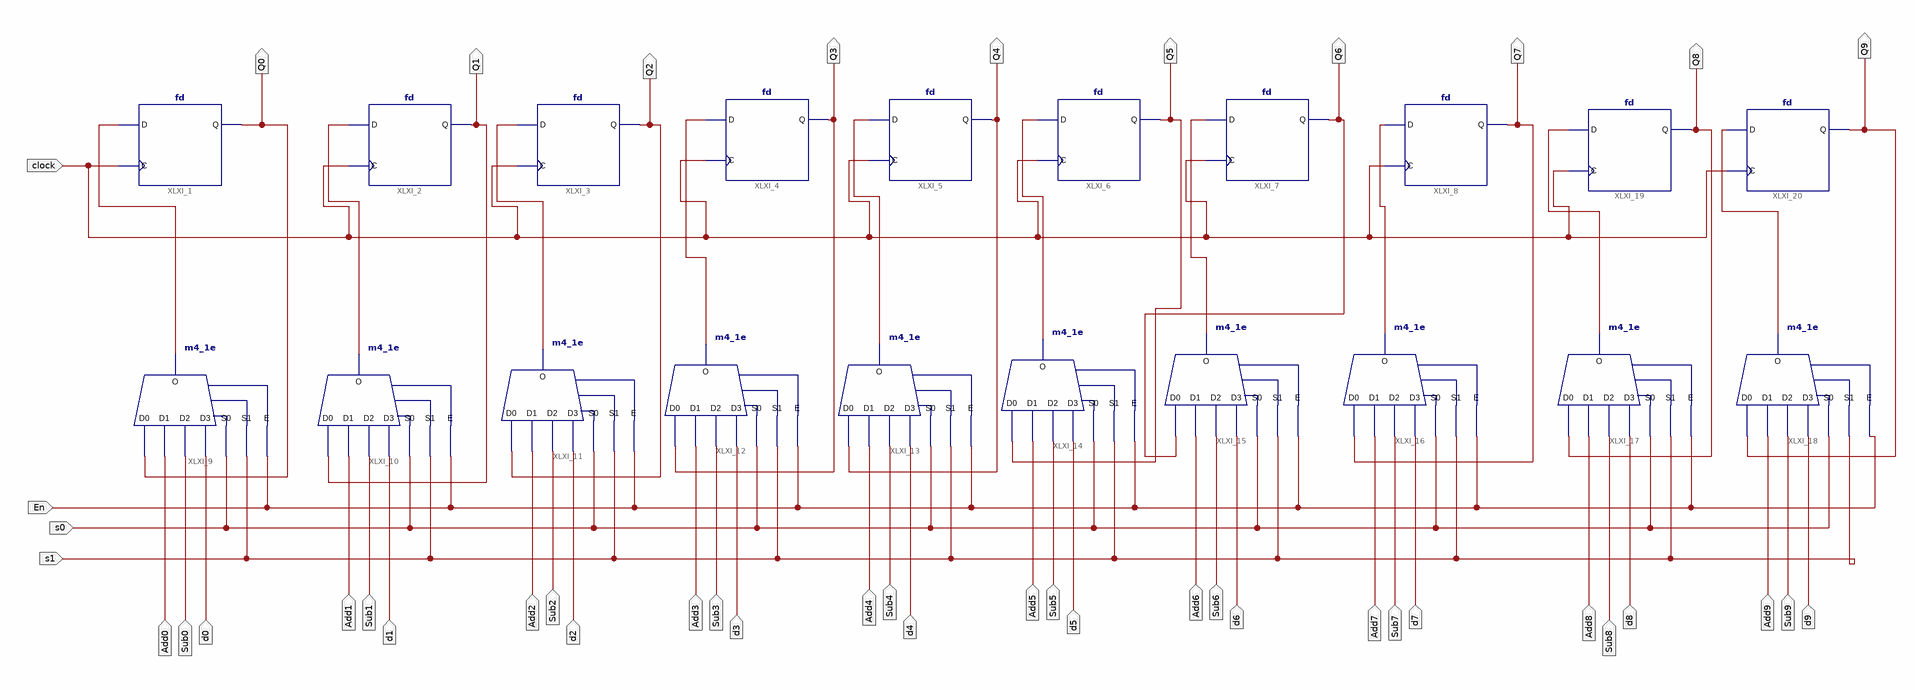
[diagram p0: schematic sheet 1]
// Xilinx ISE schematic register_def.sch (xc9500xl) as structural Verilog: 20 symbols, 44 ports
module register_def (
  input  clock,
  input  d0,
  input  d1,
  input  d2,
  input  d3,
  input  d4,
  input  d5,
  input  d6,
  input  d7,
  input  d8,
  input  d9,
  input  s1,
  input  s0,
  input  En,
  input  Add0,
  input  Sub0,
  input  Add1,
  input  Sub1,
  input  Add2,
  input  Sub2,
  input  Add3,
  input  Sub3,
  input  Add4,
  input  Sub4,
  input  Add5,
  input  Sub5,
  input  Add6,
  input  Sub6,
  input  Add7,
  input  Add8,
  input  Sub7,
  input  Sub8,
  input  Add9,
  input  Sub9,
  output Q0,
  output Q1,
  output Q2,
  output Q3,
  output Q4,
  output Q5,
  output Q6,
  output Q7,
  output Q8,
  output Q9
);

  wire XLXN_10, XLXN_11, XLXN_12, XLXN_13, XLXN_14, XLXN_15, XLXN_16, XLXN_17, XLXN_48, XLXN_49;

  fd XLXI_1 (.C(clock), .D(XLXN_10), .Q(Q0));
  fd XLXI_2 (.C(clock), .D(XLXN_11), .Q(Q1));
  fd XLXI_3 (.C(clock), .D(XLXN_12), .Q(Q2));
  fd XLXI_4 (.C(clock), .D(XLXN_13), .Q(Q3));
  fd XLXI_5 (.C(clock), .D(XLXN_14), .Q(Q4));
  fd XLXI_6 (.C(clock), .D(XLXN_15), .Q(Q5));
  fd XLXI_7 (.C(clock), .D(XLXN_16), .Q(Q6));
  fd XLXI_8 (.C(clock), .D(XLXN_17), .Q(Q7));
  m4_1e XLXI_9 (.D0(Q0), .D1(Add0), .D2(Sub0), .D3(d0), .E(En), .S0(s0), .S1(s1), .O(XLXN_10));
  m4_1e XLXI_10 (.D0(Q1), .D1(Add1), .D2(Sub1), .D3(d1), .E(En), .S0(s0), .S1(s1), .O(XLXN_11));
  m4_1e XLXI_11 (.D0(Q2), .D1(Add2), .D2(Sub2), .D3(d2), .E(En), .S0(s0), .S1(s1), .O(XLXN_12));
  m4_1e XLXI_12 (.D0(Q3), .D1(Add3), .D2(Sub3), .D3(d3), .E(En), .S0(s0), .S1(s1), .O(XLXN_13));
  m4_1e XLXI_13 (.D0(Q4), .D1(Add4), .D2(Sub4), .D3(d4), .E(En), .S0(s0), .S1(s1), .O(XLXN_14));
  m4_1e XLXI_14 (.D0(Q5), .D1(Add5), .D2(Sub5), .D3(d5), .E(En), .S0(s0), .S1(s1), .O(XLXN_15));
  m4_1e XLXI_15 (.D0(Q6), .D1(Add6), .D2(Sub6), .D3(d6), .E(En), .S0(s0), .S1(s1), .O(XLXN_16));
  m4_1e XLXI_16 (.D0(Q7), .D1(Add7), .D2(Sub7), .D3(d7), .E(En), .S0(s0), .S1(s1), .O(XLXN_17));
  m4_1e XLXI_17 (.D0(Q8), .D1(Add8), .D2(Sub8), .D3(d8), .E(En), .S0(s0), .S1(s1), .O(XLXN_48));
  m4_1e XLXI_18 (.D0(Q9), .D1(Add9), .D2(Sub9), .D3(d9), .E(En), .S0(s0), .S1(s1), .O(XLXN_49));
  fd XLXI_19 (.C(clock), .D(XLXN_48), .Q(Q8));
  fd XLXI_20 (.C(clock), .D(XLXN_49), .Q(Q9));
endmodule
